# EasyEDA schematic SCH_Auto-power-off_2024-08-13.json
TITLE: 自動電源off; REV: 1.0; Date: 2024-07-25; Sheet: 1/1; Drawn By: ruimo.uno; Company: Shisei Hanai
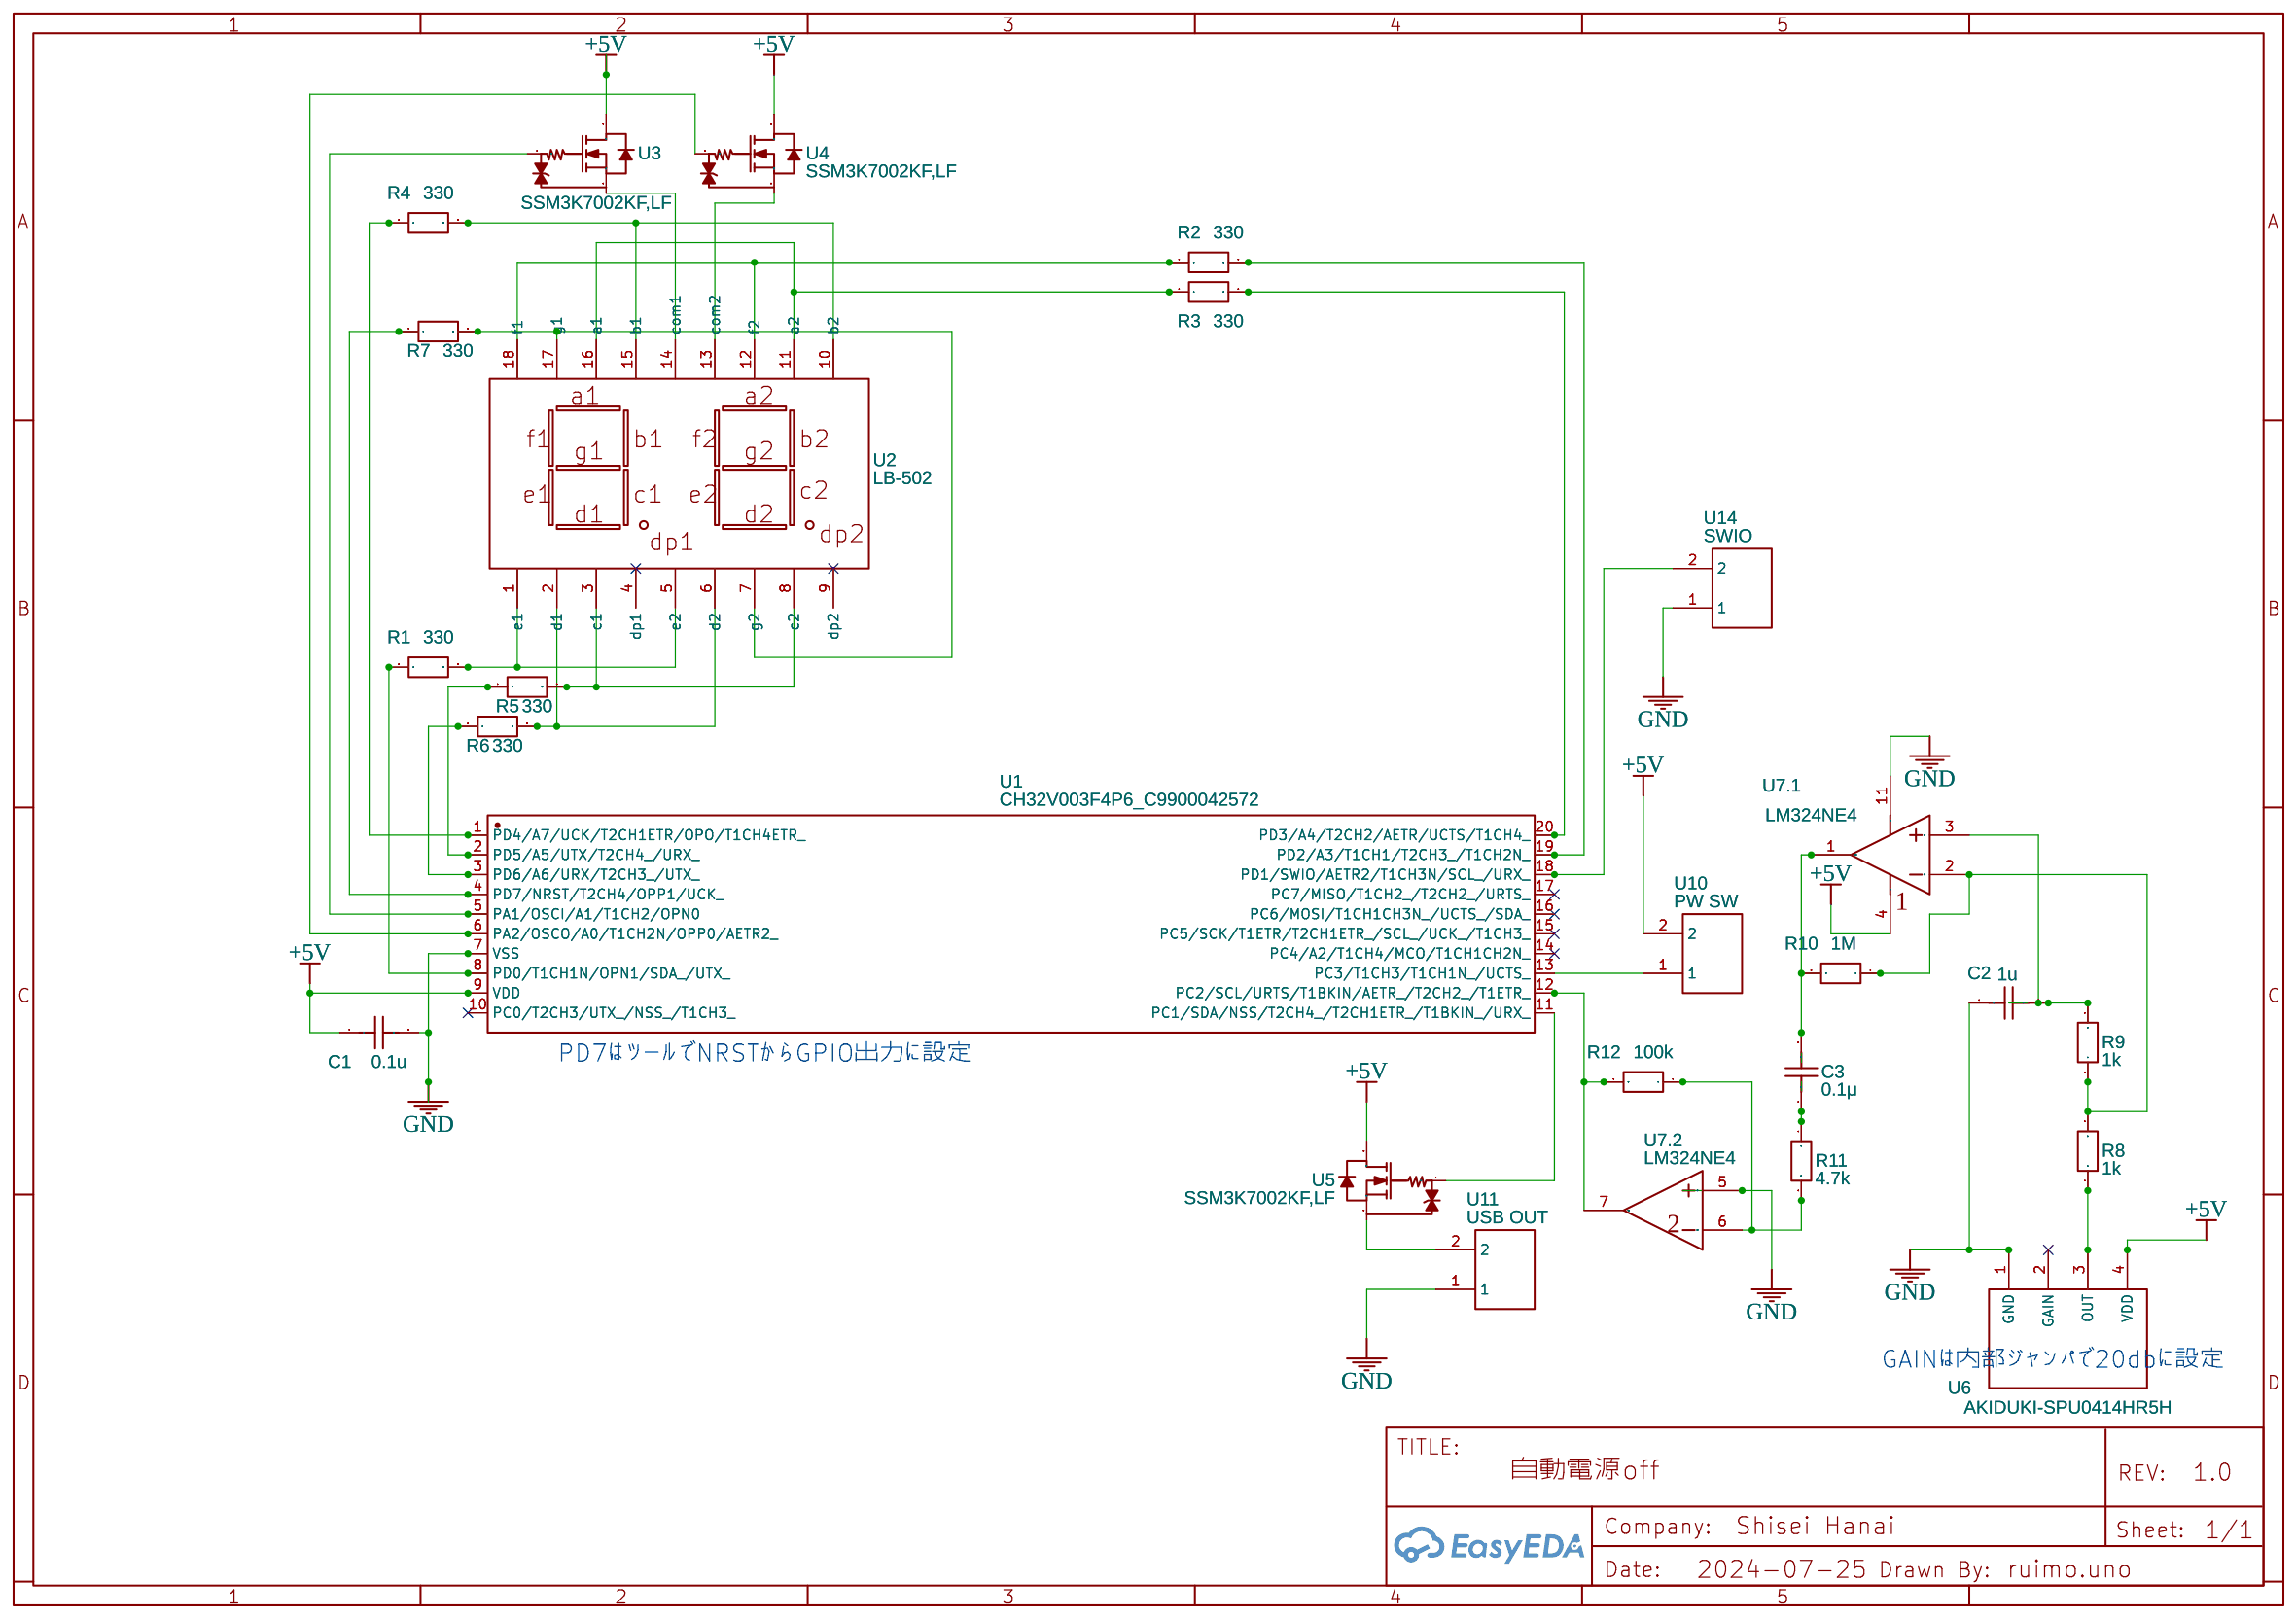
[diagram p0: schematic sheet]

## Parts
C1  0.1u  [C0805]
C2  1u  [C0805]
C3  0.1μ  [C0805]
R1  330  [R0603]
R2  330  [R0603]
R3  330  [R0603]
R4  330  [R0603]
R5  330  [R0603]
R6  330  [R0603]
R7  330  [R0603]
R8  1k  [R0603]
R9  1k  [R0603]
R10  1M  [R0603]
R11  4.7k  [R0603]
R12  100k  [R0603]
U1  CH32V003F4P6_C9900042572  [TSSOP-20_L6.5-W4.4-P0.65-LS6.4-BL]
U2  LB-502  [LB-502DN]
U3  SSM3K7002KF,LF  [S-MINI_L2.9-W1.6-P0.95-LS2.6-BR]
U4  SSM3K7002KF,LF  [S-MINI_L2.9-W1.6-P0.95-LS2.6-BR]
U5  SSM3K7002KF,LF  [S-MINI_L2.9-W1.6-P0.95-LS2.6-BR]
U6  AKIDUKI-SPU0414HR5H  [AKIDUKI-SPU0414HR5H-BOARD]
U7  LM324NE4  [PDIP-14_L19.3-W6.4-P2.54-LS7.9-BL-1]  (sections 1,2)
U10  PW SW  [2_54-2P]
U11  USB OUT  [2_54-2P]
U14  SWIO  [2_54-2P]

## Library data of the parts
C1-C3 = C_0805_US: Contributor: LCEDA_Lib
R1-R12 = R_0603_EU: Contributor: LCEDA_Lib
U1 = CH32V003F4P6_C9900042572: Contributor: lcsc; Supplier: LCSC; Supplier Part: C9900042572; Manufacturer: null; Manufacturer Part: CH32V003F4P6
U2 = LB-502: Manufacturer: ROHM; link: https://www.rohm.co.jp/products/led-displays/led-numeric-displays/two-digit/lb-502vd-product; Contributor: ruimo.uno
U3-U5 = SSM3K7002KF,LF: Supplier: LCSC; Supplier Part: C7320731; Manufacturer: TOSHIBA(东芝); Contributor: lcsc
U6 = AKIDUKI-SPU0414HR5H: Contributor: ruimo.uno
U7 = LM324NE4: subpart_no: 1; Supplier: LCSC; Supplier Part: C1348021; Manufacturer: TI(德州仪器); JLCPCB Part Class: Extended Part
U10 U11 U14 = 2_54-2PIN: Contributor: ruimo.uno

## Nets
+5V: C1.1 U1.9(VDD) U3.3(D) U4.3(D) U5.3(D) U6.4(VDD) U7.4(VCC) U10.2
GND: C1.2 C2.1 U1.7(VSS) U6.1(GND) U7.5(IN2+) U7.11(GND) U11.1 U14.1
Net-(C2-2): C2.2 R9.2 U7.3(IN1+)
Net-(C3-1): C3.1 R11.1
Net-(C3-2): C3.2 R10.2 U7.1(OUT1)
Net-(R1-1): R1.1 U1.8(PD0/T1CH1N/OPN1/SDA_/UTX_)
Net-(R1-2): R1.2 U2.1(e1) U2.5(e2)
Net-(R2-1): R2.1 U2.12(f2) U2.18(f1)
Net-(R2-2): R2.2 U1.19(PD2/A3/T1CH1/T2CH3_/T1CH2N_)
Net-(R3-1): R3.1 U2.11(a2) U2.16(a1)
Net-(R3-2): R3.2 U1.20(PD3/A4/T2CH2/AETR/UCTS/T1CH4_)
Net-(R4-1): R4.1 U1.1(PD4/A7/UCK/T2CH1ETR/OPO/T1CH4ETR_)
Net-(R4-2): R4.2 U2.10(b2) U2.15(b1)
Net-(R5-1): R5.1 U1.2(PD5/A5/UTX/T2CH4_/URX_)
Net-(R5-2): R5.2 U2.3(c1) U2.8(c2)
Net-(R6-1): R6.1 U1.3(PD6/A6/URX/T2CH3_/UTX_)
Net-(R6-2): R6.2 U2.2(d1) U2.6(d2)
Net-(R7-1): R7.1 U1.4(PD7/NRST/T2CH4/OPP1/UCK_)
Net-(R7-2): R7.2 U2.7(g2) U2.17(g1)
Net-(R8-1): R8.1 U6.3(OUT)
Net-(R8-2): R8.2 R9.1 R10.1 U7.2(IN1-)
Net-(R11-2): R11.2 R12.1 U7.6(IN2-)
Net-(R12-2): R12.2 U1.12(PC2/SCL/URTS/T1BKIN/AETR_/T2CH2_/T1ETR_) U7.7(OUT2)
Net-(U1-5): U1.5(PA1/OSCI/A1/T1CH2/OPN0) U3.1(G)
Net-(U1-6): U1.6(PA2/OSCO/A0/T1CH2N/OPP0/AETR2_) U4.1(G)
Net-(U1-11): U1.11(PC1/SDA/NSS/T2CH4_/T2CH1ETR_/T1BKIN_/URX_) U5.1(G)
Net-(U1-13): U1.13(PC3/T1CH3/T1CH1N_/UCTS_) U10.1
Net-(U1-18): U1.18(PD1/SWIO/AETR2/T1CH3N/SCL_/URX_) U14.2
Net-(U2-13): U2.13(com2) U4.2(S)
Net-(U2-14): U2.14(com1) U3.2(S)
Net-(U5-2): U5.2(S) U11.2

Not connected (* = marked no-connect by the designer): U1 10(PC0/T2CH3/UTX_/NSS_/T1CH3_)* 14(PC4/A2/T1CH4/MCO/T1CH1CH2N_)* 15(PC5/SCK/T1ETR/T2CH1ETR_/SCL_/UCK_/T1CH3_)* 16(PC6/MOSI/T1CH1CH3N_/UCTS_/SDA_)* 17(PC7/MISO/T1CH2_/T2CH2_/URTS_)*; U2 4(dp1)* 9(dp2)*; U6 2(GAIN)*

## Notes on the sheet
- PD7はツールでNRSTからGPIO出力に設定
- GAINは内部ジャンパで20dbに設定
